# Altium project JacdacEc30Template30x20 104.PrjPCB
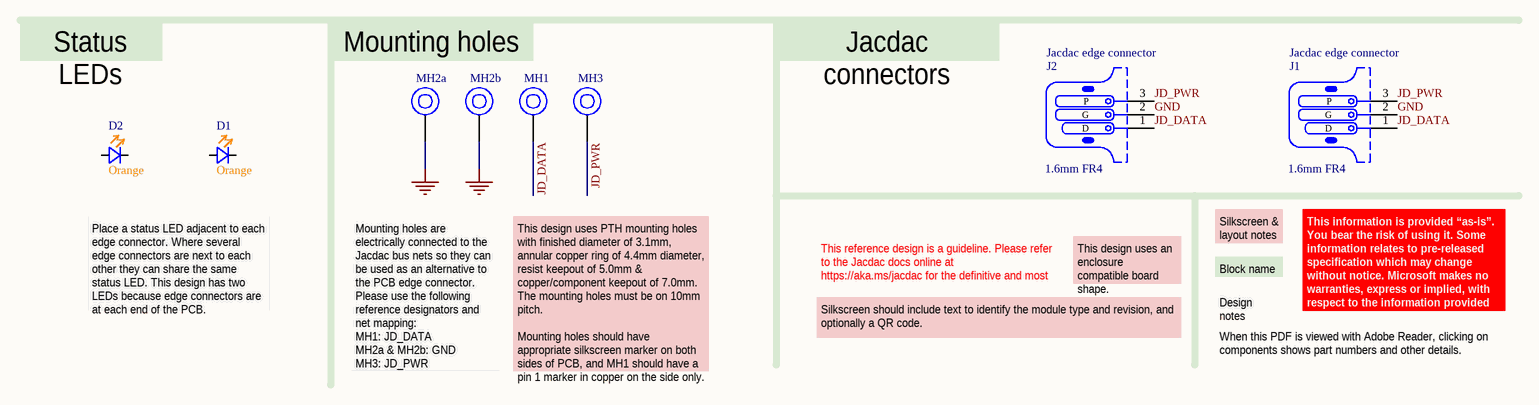
[diagram p0: JacdacEc30Template30x20 104.SchDoc]
ProjectRevision: 0.1; ProjectLicenceTerms: Attribution 4.0 International (CC BY 4.0); ProjectDrawnBy: S. Hodges; ProjectCodenameID: 104; ProjectCodenameDescription: Jacdac "EC" template: 30x20mm MH, 1+1 conns; ProjectCodeName: JacdacEc30Template30x20
1 sheet, 8 parts. Net scope: global (net labels, ports and power ports of the same name join across sheets).
Board file: JacdacEc30Template30x20 104.PcbDoc

## Sheet JacdacEc30Template30x20 104.SchDoc: Complete design
size A4; DrawnBy: S. Hodges; DocumentNumber: 1; Revision: 0.1; SheetNumber: 1; SheetTotal: 1; VersionControl_RevNumber: 1

### Parts
D1  Colour: Orange  [0603 Orange]  (hidden comment: 19-217/S2C-AQ1R1B/3T)
D2  Colour: Orange  [0603 Orange]  (hidden comment: 19-217/S2C-AQ1R1B/3T)
J1  Jacdac edge connector  PCB Type: 1.6mm FR4  [JACDAC_EDGE_CONNECTOR_NO_TRACES_V2DIMS]  (no BOM)
J2  Jacdac edge connector  PCB Type: 1.6mm FR4  [JACDAC_EDGE_CONNECTOR_NO_TRACES_V2DIMS]  (no BOM)
MH1  MH_6.5MMK_4.5MMC_3.0MMD_PTH  [MH_6.5MMK_4.5MMC_3.0MMD_PTH]  (value not drawn)  (no BOM)
MH2a  MH_6.5MMK_4.5MMC_3.0MMD_PTH  [MH_6.5MMK_4.5MMC_3.0MMD_PTH]  (value not drawn)  (no BOM)
MH2b  MH_6.5MMK_4.5MMC_3.0MMD_PTH  [MH_6.5MMK_4.5MMC_3.0MMD_PTH]  (value not drawn)  (no BOM)
MH3  MH_6.5MMK_4.5MMC_3.0MMD_PTH  [MH_6.5MMK_4.5MMC_3.0MMD_PTH]  (value not drawn)  (no BOM)

### Nets
GND: J1.2(G) J2.2(G) MH2a.1 MH2b.1
JD_DATA: J1.1(D) J2.1(D) MH1.1
JD_PWR: J1.3(P) J2.3(P) MH3.1

Not connected (* = marked no-connect by the designer): D1 1(K) 2(A); D2 1(K) 2(A)

### Notes on the sheet
- Status LEDs
- Mounting holes
- Jacdac connectors
- This reference design is a guideline. Please refer to the Jacdac docs online at https://aka.ms/jacdac for the definitive and most up-to-date information.
- This design uses an enclosure compatible board shape.
- Block name
- Silkscreen & layout notes
- Place a status LED adjacent to each edge connector. Where several edge connectors are next to each other they can share the same status LED. This design has two LEDs because edge connectors are at each end of the PCB.
- Mounting holes are electrically connected to the Jacdac bus nets so they can be used as an alternative to the PCB edge connector. Please use the following reference designators and net mapping:
- Silkscreen should include text to identify the module type and revision, and optionally a QR code.
- Design notes
- When this PDF is viewed with Adobe Reader, clicking on components shows part numbers and other details.
- This information is provided “as-is”. You bear the risk of using it. Some information relates to pre-released specification which may change without notice. Microsoft makes no warranties, express or implied, with respect to the information provided here.
- MH1: JD_DATA
  MH2a & MH2b: GND
  MH3: JD_PWR
- This design uses PTH mounting holes with finished diameter of 3.1mm, annular copper ring of 4.4mm diameter, resist keepout of 5.0mm & copper/component keepout of 7.0mm. The mounting holes must be on 10mm pitch.
  Mounting holes should have appropriate silkscreen marker on both sides of PCB, and MH1 should have a pin 1 marker in copper on the side only.
- PROJECT FILENAME
- PROJECT CODENAME
- Microsoft
- PROJECT DESCRIPTION
- SHEET DESCRIPTION
- SHEET FILENAME
- LICENCE
- LAST MODIFIED
- PAGE
- OF
- DRAWN BY
- REVISION
- PCB ID

### Library data of the parts
D1 D2 = 19-217/S2C-AQ1R1B/3T: LED ORANGE DIFFUSED 0603 SMD; Manufacturer: Everlight Elec; Manufacturer Part Number: 19-217/S2C-AQ1R1B/3T; Mount: Surface Mount; Case/Package: 0603; Color: Orange; Case Code (Imperial): 0603; ComponentLink1URL: https://datasheet.lcsc.com/lcsc/1912171731_Everlight-Elec-19-217-S2C-AQ1R1B-3T_C146215.pdf; ComponentLink1Description: Online datasheet; Supplier 1: LCSC; Supplier 1 Part Number: C146215
J1 J2 = Jacdac edge connector: 3 pin Jacdac edge connector 1.27mm pitch; Manufacturer Part Number: JACDAC_EDGE_CONNECTOR; Checked By: ?; Created By: D. Gakure; ComponentLink1Description: Yuliang JACDAC cable connector drawing online; ComponentLink1URL: https://github.com/microsoft/jacdac-mdk/blob/main/connector/JACDAC-Connector-by-Yuliang-2020-11-28.pdf; ComponentLink2Description: JACDAC PCB edge connector spec onlin; ComponentLink2URL: https://github.com/microsoft/jacdac-mdk/blob/main/connector/JACDAC_PCB_Edge_Connector_Drawing_JD-PEC-01_rev_01.pdf
MH1 MH2a MH2b MH3 = MH_6.5MMK_4.5MMC_3.0MMD_PTH: Mounting Hole 6.5mm keepout, 4.5mm annualar ring and 3.0mm Drill PTH